# Altium schematic sheet Fourier.SchDoc
size Letter
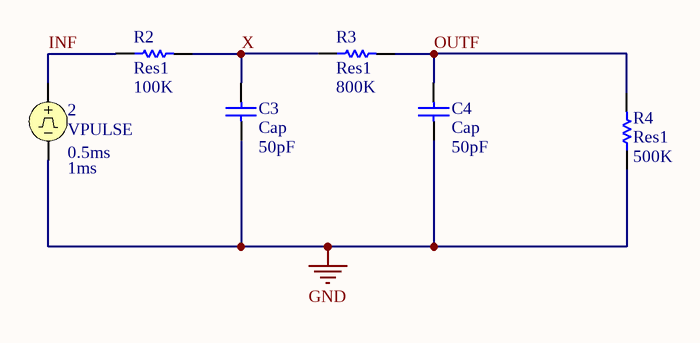
[diagram p0: Fourier.SchDoc]

## Parts
2  VPULSE  Pulse Width: 0.5ms  Period: 1ms
C3  Cap  value 50pF  [RAD-0.3]
C4  Cap  value 50pF  [RAD-0.3]
R2  Res1  value 100K  [AXIAL-0.3]
R3  Res1  value 800K  [AXIAL-0.3]
R4  Res1  value 500K  [AXIAL-0.3]

## Nets
GND: 2.2 C3.1 C4.1 R4.1
INF: 2.1 R2.1
OUTF: C4.2 R3.2 R4.2
X: C3.2 R2.2 R3.1

## Notes on the sheet
- Project:
- Page content:
- Size:
- Revisión
- Letter
- Document Number
- Design:
- Date:
- Sheet:
- of

## Library data of the parts
2 = VPULSE: Pulse Voltage Source; Note: PCB Footprint - Not required; Published: 8-Jun-2000; LatestRevisionDate: 15-Nov-2004; LatestRevisionNote: Corrected Netlist.; PackageReference: Not Applicable; Publisher: Altium Limited
C3 C4 = Cap: Capacitor; Published: 8-Jun-2000; LatestRevisionDate: 17-Jul-2002; LatestRevisionNote: Re-released for DXP Platform.; PackageReference: RAD-0.3; Publisher: Altium Limited; PackageDescription: Radial Cap, Thru-Hole; 2 Leads; 0.3 in Pin Spacing
R2-R4 = Res1: Resistor; Published: 8-Jun-2000; LatestRevisionDate: 17-Jul-2002; LatestRevisionNote: Re-released for DXP Platform.; PackageReference: AXIAL-0.3; Publisher: Altium Limited; PackageDescription: Axial Device, Thru-Hole; 2 Leads; 0.3 in Pin Spacing